# EAGLE design untitled (EAGLE 9.6.2)
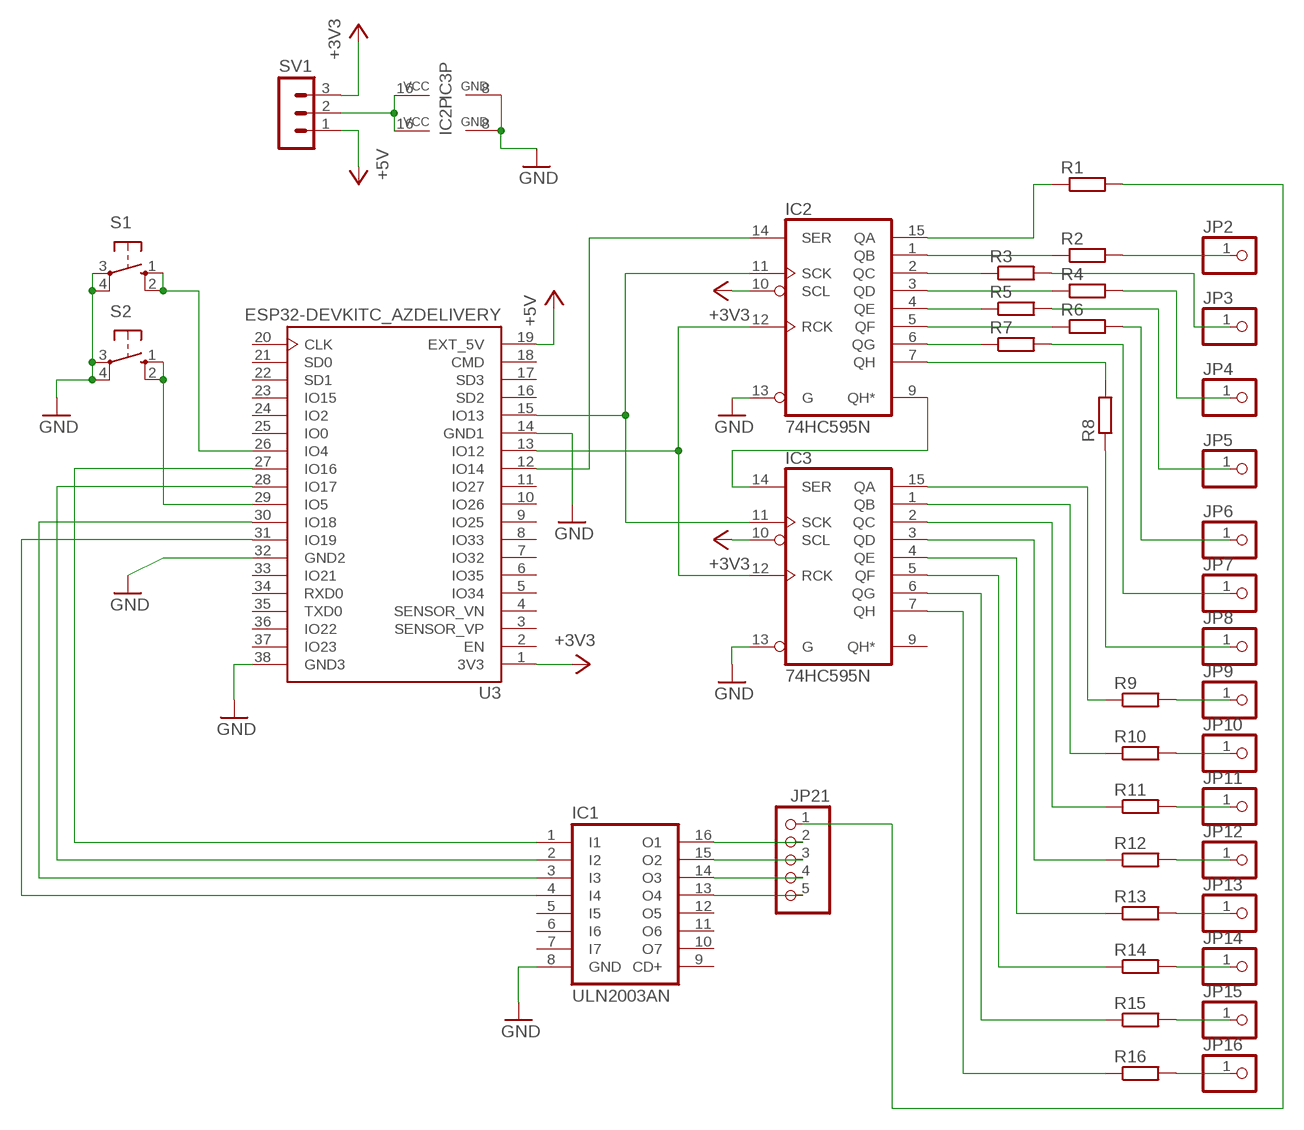
[diagram p0: schematic, sheet 1]

## Parts
IC1  ULN2003AN  [DIL16]
IC2  74HC595N  [DIL16]
IC3  74HC595N  [DIL16]
JP2  PINHD-1X1  [1X01]
JP3  PINHD-1X1  [1X01]
JP4  PINHD-1X1  [1X01]
JP5  PINHD-1X1  [1X01]
JP6  PINHD-1X1  [1X01]
JP7  PINHD-1X1  [1X01]
JP8  PINHD-1X1  [1X01]
JP9  PINHD-1X1  [1X01]
JP10  PINHD-1X1  [1X01]
JP11  PINHD-1X1  [1X01]
JP12  PINHD-1X1  [1X01]
JP13  PINHD-1X1  [1X01]
JP14  PINHD-1X1  [1X01]
JP15  PINHD-1X1  [1X01]
JP16  PINHD-1X1  [1X01]
JP21  PINHD-1X5  [1X05]
R1  R-EU_0207/10  [0207/10]
R2  R-EU_0207/10  [0207/10]
R3  R-EU_0207/10  [0207/10]
R4  R-EU_0207/10  [0207/10]
R5  R-EU_0207/10  [0207/10]
R6  R-EU_0207/10  [0207/10]
R7  R-EU_0207/10  [0207/10]
R8  R-EU_0207/10  [0207/10]
R9  R-EU_0207/10  [0207/10]
R10  R-EU_0207/10  [0207/10]
R11  R-EU_0207/10  [0207/10]
R12  R-EU_0207/10  [0207/10]
R13  R-EU_0207/10  [0207/10]
R14  R-EU_0207/10  [0207/10]
R15  R-EU_0207/10  [0207/10]
R16  R-EU_0207/10  [0207/10]
S1  10-XX  [B3F-10XX]
S2  10-XX  [B3F-10XX]
SV1  MA03-1  [MA03-1]
U3  ESP32-DEVKITC_AZDELIVERY  [FP_ESP32-DEVKIT_AZDELIVERY]

## Nets
+3V3: IC2.10(SCL) IC3.10(SCL) SV1.3 U3.1(3V3)
+5V: SV1.1 U3.19(EXT_5V)
GND: IC1.8(GND) IC2.8(GND) IC2.13(G) IC3.8(GND) IC3.13(G) S1.3(P) S1.4(P1) S2.3(P) S2.4(P1) U3.14(GND1) U3.32(GND2) U3.38(GND3)
N$1: IC2.11(SCK) IC3.11(SCK) U3.15(IO13)
N$2: IC2.12(RCK) IC3.12(RCK) U3.13(IO12)
N$3: IC2.14(SER) U3.12(IO14)
N$4: IC2.9(QH*) IC3.14(SER)
N$5: JP21.1 R1.2
N$6: IC1.16(O1) JP21.2
N$7: IC1.15(O2) JP21.3
N$8: IC1.14(O3) JP21.4
N$9: IC2.15(QA) R1.1
N$10: IC2.1(QB) R2.1
N$11: JP3.1 R3.2
N$12: JP4.1 R4.2
N$13: JP5.1 R5.2
N$14: JP6.1 R6.2
N$15: JP7.1 R7.2
N$16: JP8.1 R8.1
N$17: IC3.15(QA) R9.1
N$18: IC3.1(QB) R10.1
N$19: IC3.2(QC) R11.1
N$20: IC3.3(QD) R12.1
N$21: IC3.4(QE) R13.1
N$22: IC3.5(QF) R14.1
N$23: IC3.6(QG) R15.1
N$24: IC3.7(QH) R16.1
N$25: IC1.1(I1) U3.27(IO16)
N$26: IC1.2(I2) U3.28(IO17)
N$27: IC1.3(I3) U3.30(IO18)
N$28: IC1.4(I4) U3.31(IO19)
N$29: S1.1(S) S1.2(S1) U3.26(IO4)
N$30: S2.1(S) S2.2(S1) U3.29(IO5)
N$31: IC1.13(O4) JP21.5
N$32: JP2.1 R2.2
N$33: IC2.2(QC) R3.1
N$34: IC2.3(QD) R4.1
N$35: IC2.4(QE) R5.1
N$36: IC2.5(QF) R6.1
N$37: IC2.6(QG) R7.1
N$38: IC2.7(QH) R8.2
N$39: JP9.1 R9.2
N$40: JP10.1 R10.2
N$41: JP11.1 R11.2
N$42: JP12.1 R12.2
N$43: JP13.1 R13.2
N$44: JP14.1 R14.2
N$45: JP15.1 R15.2
N$46: JP16.1 R16.2
N$47: IC2.16(VCC) IC3.16(VCC) SV1.2
Unconnected: IC1.5(I5) IC1.6(I6) IC1.7(I7) IC1.9(CD+) IC1.10(O7) IC1.11(O6) IC1.12(O5) IC3.9(QH*) U3.2(EN) U3.3(SENSOR_VP) U3.4(SENSOR_VN) U3.5(IO34) U3.6(IO35) U3.7(IO32) U3.8(IO33) U3.9(IO25) U3.10(IO26) U3.11(IO27) U3.16(SD2) U3.17(SD3) U3.18(CMD) U3.20(CLK) U3.21(SD0) U3.22(SD1) U3.23(IO15) U3.24(IO2) U3.25(IO0) U3.33(IO21) U3.34(RXD0) U3.35(TXD0) U3.36(IO22) U3.37(IO23)

## Library data of the parts
IC1 = uln-udn:ULN2003A: DRIVER ARRAY
IC2 IC3 = 74xx-eu:74*595: 8-bit SHIFT REGISTER, output latch
JP2-JP16 = adafruit:PINHD-1X1: Pin header 1x1 for 0.1" spacing With round pins
JP21 = pinhead:PINHD-1X5: PIN HEADER
R1-R16 = rcl:R-EU_: RESISTOR, European symbol; SPICEPREFIX: R
S1 S2 = switch-omron:10-XX: OMRON SWITCH; MPN: B3F-1000; OC_FARNELL: 176432; OC_NEWARK: 36M3542
SV1 = con-lstb:MA03-1: PIN HEADER; OC_FARNELL: unknown; OC_NEWARK: unknown
U3 = ESP32-DEVKITC-AZDELIVERY:ESP32-DEVKITC_AZDELIVERY: Eval Board For Esp-Wroom-32; AVAILABILITY: Unavailable; DESCRIPTION: - Transceiver; 802.11 b/g/n _Wi-Fi, WiFi, WLAN_, Bluetooth® Smart Ready 4.x Dual Mode For Use With ESP-WROOM-32; MF: Espressif Systems; MP: ESP32-DEVKITC-32D; PACKAGE: None; PRICE: None

## Board
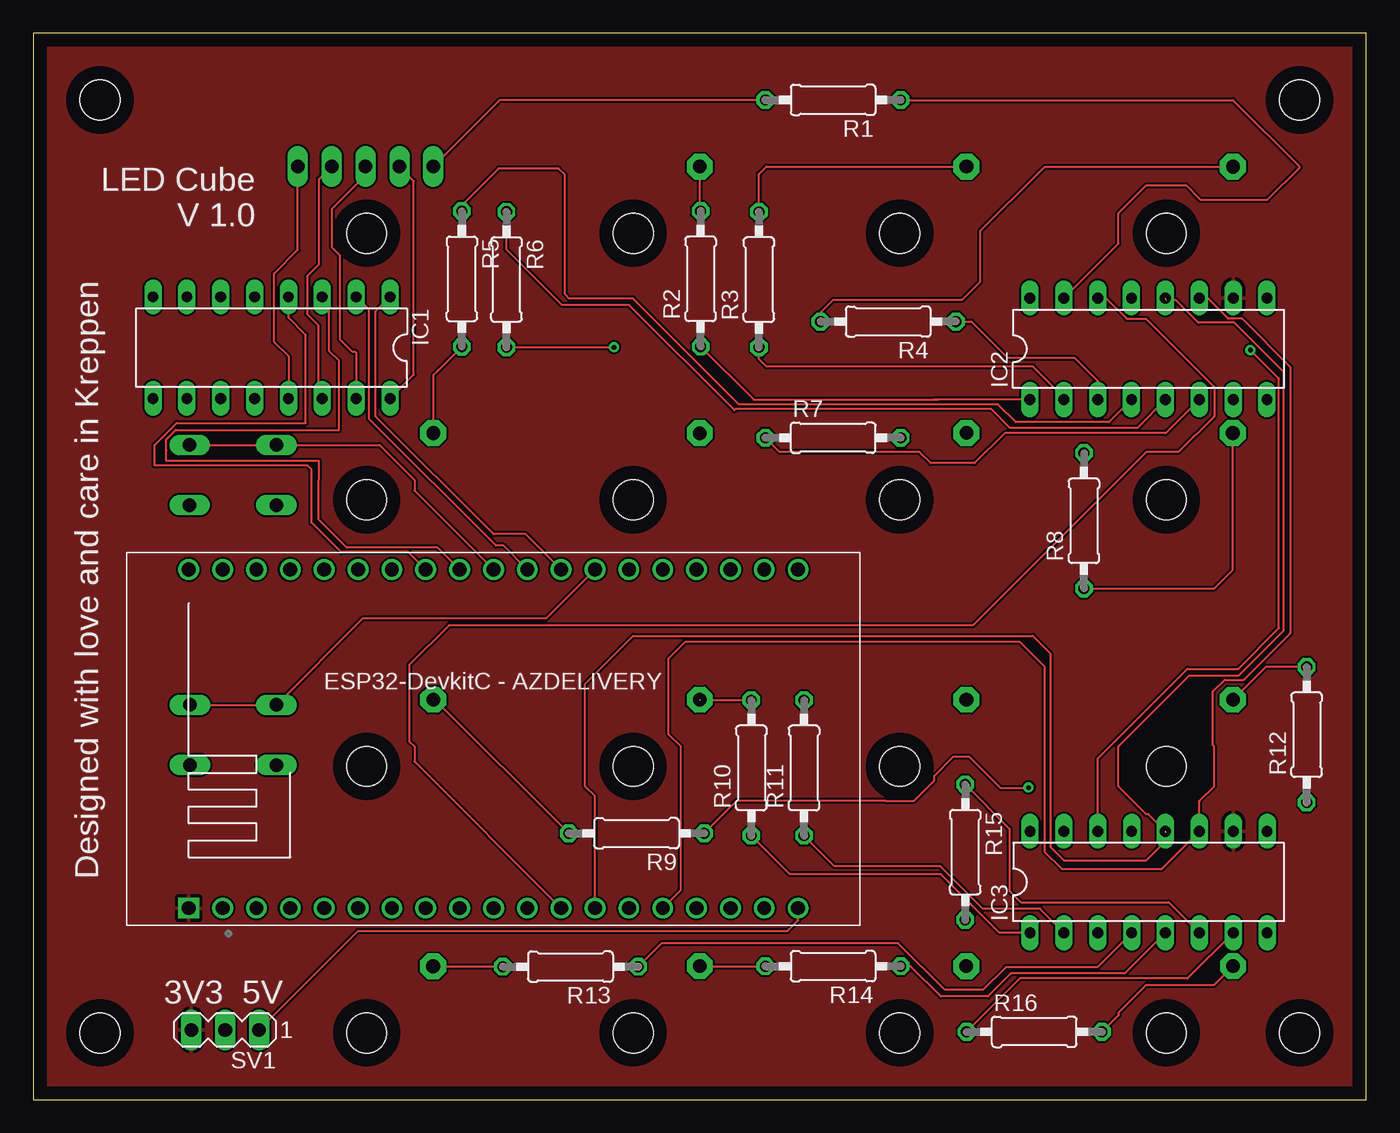
[diagram p1: board, top side]
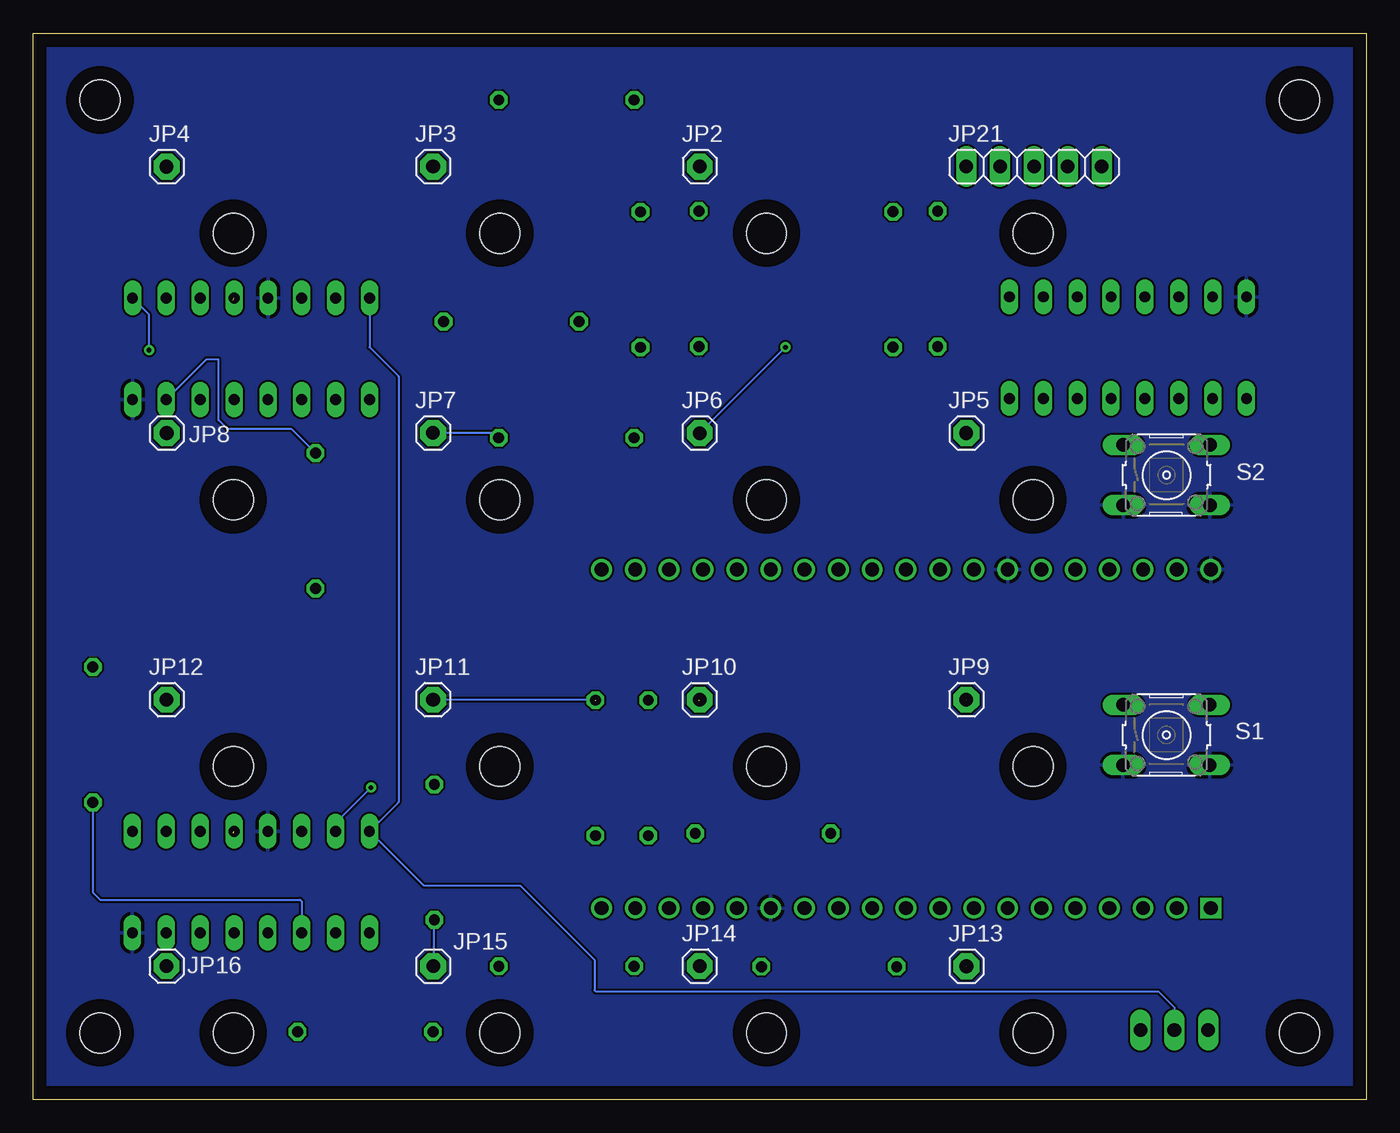
[diagram p2: board, bottom side, seen from below]

Size 100 x 80 mm. Coordinates in mm from the lower left corner, seen from the top.
Outline: 0,0 100,0 100,80 0,80 0,0
Copper layers (1*16): Top 0.035mm / dielectric 1.5mm / Bottom 0.035mm
Design rules "default": minimum track width 6mil, minimum drill 0.35mm, track to track 6mil, track to pad 6mil, pad to pad 6mil, via to via 6mil, smd to smd 6mil, copper to edge 40mil, drill to drill 6mil, minimum pad ring 10mil, minimum via ring 8mil, stop-mask expansion 4mil, vias tented up to drill 0mil, thermal gap 10mil
Holes 3 mm at 5,75 45,65 65,65 25,65 85,65 85,45 65,45 45,45 25,45 25,25 25,5 45,5 45,25 65,5 65,25 85,25 85,5 95,75 95,5 5,5

### Footprints (pad centres in the part's own frame; a part is rotated, then mirrored left to right if it is on the bottom)
DIL16 = drill 0.813 long: 1 -8.89,-3.81; 2 -6.35,-3.81; 3 -3.81,-3.81; 4 -1.27,-3.81; 5 1.27,-3.81; 6 3.81,-3.81; 7 6.35,-3.81; 8 8.89,-3.81; 9 8.89,3.81; 10 6.35,3.81; 11 3.81,3.81; 12 1.27,3.81; 13 -1.27,3.81; 14 -3.81,3.81; 15 -6.35,3.81; 16 -8.89,3.81
1X01 = drill 1.016 pad 1.93 octagon: 1 0,0
1X05 = drill 1.016 long: 1 -5.08,0; 2 -2.54,0; 3 0,0; 4 2.54,0; 5 5.08,0
0207/10 = drill 0.813 octagon: 1 -5.08,0; 2 5.08,0
B3F-10XX = drill 1.016 long: 1 -3.251,2.261; 2 3.251,2.261; 3 -3.251,-2.261; 4 3.251,-2.261
MA03-1 = drill 1.016 long: 1 -2.54,0; 2 0,0; 3 2.54,0
FP_ESP32-DEVKIT_AZDELIVERY = drill 1.04 square: 1 -12.7,22.86 | drill 1.04: 2 -12.7,20.32; 3 -12.7,17.78; 4 -12.7,15.24; 5 -12.7,12.7; 6 -12.7,10.16; 7 -12.7,7.62; 8 -12.7,5.08; 9 -12.7,2.54; 10 -12.7,0; 11 -12.7,-2.54; 12 -12.7,-5.08; 13 -12.7,-7.62; 14 -12.7,-10.16; 15 -12.7,-12.7; 16 -12.7,-15.24; 17 -12.7,-17.78; 18 -12.7,-20.32; 19 -12.7,-22.86; 20 12.7,-22.86; 21 12.7,-20.32; 22 12.7,-17.78; 23 12.7,-15.24; 24 12.7,-12.7; 25 12.7,-10.16; 26 12.7,-7.62; 27 12.7,-5.08; 28 12.7,-2.54; 29 12.7,0; 30 12.7,2.54; 31 12.7,5.08; 32 12.7,7.62; 33 12.7,10.16; 34 12.7,12.7; 35 12.7,15.24; 36 12.7,17.78; 37 12.7,20.32; 38 12.7,22.86

### Placement (x,y rotation side)
IC1  17.87,56.41 180 top
IC2  83.67,56.33 0 top
IC3  83.67,16.32 0 top
JP2  50,70 0 bottom
JP3  70.01,70 0 bottom
JP4  90,69.99 0 bottom
JP5  30,50.01 0 bottom
JP6  50.01,50 0 bottom
JP7  70.01,50.01 0 bottom
JP8  89.99,50.01 0 bottom
JP9  30,30 0 bottom
JP10  50.01,29.99 0 bottom
JP11  70.01,30 0 bottom
JP12  90,30 0 bottom
JP13  30,10 0 bottom
JP14  50.01,10 0 bottom
JP15  70,10 0 bottom
JP16  90,10.01 0 bottom
JP21  24.92,70 0 bottom
R1  60,75 180 top
R2  50.06,61.58 90 top
R3  54.44,61.52 90 top
R4  64.14,58.37 180 top
R5  32.15,61.58 270 top
R6  35.5,61.53 270 top
R7  60.01,49.65 0 top
R8  78.83,43.43 90 top
R9  45.26,19.97 180 top
R10  53.87,24.88 90 top
R11  57.83,24.88 90 top
R12  95.53,27.37 90 top
R13  40.3,9.97 180 top
R14  60,10 180 top
R15  69.92,18.56 270 top
R16  75.09,5.08 0 top
S1  14.99,27.35 0 bottom
S2  14.98,46.85 0 bottom
SV1  14.39,5.22 180 top
U3  34.52,27.06 90 top

### Tracks (layer width: path | path; a pad name or v marks a point on that pad's centre or on a via)
+3V3
  pour Top: 0,80 100,80 100,0 0,0
+5V
  Top 0.152: SV1.1 24.36,12.65 56.59,12.65 57.38,13.44 U3.19
GND
  pour Bottom: 0,80 100,80 100,0 0,0
N$1
  Top 0.152: IC2.11 88.1,60.14 89.65,58.59 90.69,58.59 94.34,54.94 94.34,35.02 90.82,31.5 89.38,31.5 88.5,30.62 88.5,26.58 88.59,26.49 88.59,23.51 87.48,22.4 IC3.11 84.65,17.3 77.15,17.3 75.86,18.59 75.86,32.48 73.99,34.35 48.94,34.35 47.67,33.08 47.67,27.41 48.59,26.49 48.59,15.73 U3.15
N$2  (2 unrouted)
  Top 0.152: IC3.12 83.66,21.41 83.51,21.41 81.41,23.51 81.41,26.49 86.72,31.8 90.43,31.8 93.82,35.2 93.82,54.59 90.12,58.28 87.42,58.28 85.7,60 85,60 | U3.13 42.14,22.78 41.41,23.51 41.41,31.2 45,34.79 75,34.79 76.31,33.49 76.31,18.97 77.32,17.95 83.52,17.95 85,19.44 85,20
N$3
  Top 0.152: IC2.14 80.48,60.14 82.03,58.59 83.46,58.59 88.59,53.46 88.59,51.26 85.92,48.59 83.51,48.59 70.5,35.59 31.18,35.59 28.21,32.62 28.21,26.87 28.59,26.49 28.59,25.37 U3.12
N$4  (via drill 0.35)
  Top 0.152: IC3.14 79.86,25.59 86.58,32.31 90.34,32.31 90.36,32.28 93.45,35.37 93.45,54.1 v91.31,56.24
  Bottom 0.152: v91.31,56.24 91.31,58.89 IC2.9
N$5
  Top 0.152: JP21.1 35,75 R1.2
N$6
  Top 0.152: IC1.16 28.55,54.39 28.55,68.92 JP21.2
N$7
  Top 0.152: IC1.15 24.22,56.03 24.13,56.12 23.92,56.12 22.99,57.05 22.99,63.34 22.41,63.93 22.41,66.83 24.99,69.42 24.99,69.94 JP21.3
N$8
  Top 0.152: IC1.14 21.38,52.9 21.38,58.1 20.54,58.93 20.54,61.77 21.44,62.67 21.44,69.06 JP21.4
N$9
  Top 0.152: IC2.15 81.41,64.23 81.41,66.49 83.51,68.59 86.49,68.59 87.58,67.51 92.59,67.51 95,69.92 95,70 90,75 R1.1
N$10
  Top 0.152: IC2.1 67.88,52.52 | 67.88,52.52 67.48,52.52 | R2.1 54.06,52.5 67.87,52.5 67.88,52.52
N$11
  Top 0.152: R3.2 54.44,69.44 55,70 JP3.1
N$12
  Top 0.152: R4.2 59.06,59.06 60,60 69.68,60 71.03,61.35 71.03,65.15 75.44,69.56 75.88,69.99 JP4.1
N$13
  Top 0.152: R5.2 30.33,54.67 30,54.34 JP5.1
N$14  (via drill 0.35)
  Top 0.152: R6.2 v43.56,56.45
  Bottom 0.152: v43.56,56.45 JP6.1
N$15
  Bottom 0.152: JP7.1 65.44,50.01 R7.2
N$16
  Top 0.152: R8.1 88.6,38.35 89.99,39.74 JP8.1
  Bottom 0.152: 90.02,50.03 JP8.1
N$17  (via drill 0.35)
  Top 0.152: R9.1 52.8,22.44 63.9,22.44 63.93,22.41 66.07,22.41 67.59,23.93 67.59,24.28 69.05,25.74 70.19,25.74 72.56,23.37 74.64,23.37 v74.67,23.41
  Bottom 0.152: v74.67,23.41 77.32,20.75 IC3.15
N$18
  Top 0.152: IC3.1 72.49,12.51 68.1,16.9 56.77,16.9 R10.1
N$19
  Top 0.152: IC3.2 75.52,14.31 71.26,14.31 68.07,17.5 60.12,17.5 R11.1
N$20
  Bottom 0.152: R12.1 95.53,15.53 95,15 80,15 79.86,14.86 IC3.3
N$21
  Top 0.152: IC3.4 79.83,9.93 72.96,9.93 71.26,8.23 68.38,8.23 64.87,11.74 47.15,11.74 R13.1
N$22
  Top 0.152: IC3.5 81.89,9.46 73.35,9.46 71.63,7.74 68.09,7.74 65.82,10 R14.1
N$23
  Top 0.152: R15.1 73.25,20.31 73.25,15.66 74.09,14.81 85.18,14.81 IC3.6
N$24
  Top 0.152: 90,12.49 IC3.7 86.59,9.08 74.01,9.08 R16.1
N$25
  Top 0.152: 26.9,60.22 IC1.1 25.69,59.15 25.69,51.26 34.52,42.43 36.93,42.43 U3.27
N$26
  Top 0.152: U3.28 35.26,41.56 34.71,41.56 25.19,51.07 25.19,59.25 IC1.2
N$27
  Top 0.152: U3.30 30.33,41.41 23.51,41.41 21.41,43.51 21.41,46.49 21.44,46.52 21.44,47.9 21.42,47.92 10,47.92 9.98,47.95 9.98,48.7 | 9.98,48.7 9.98,49.52 10.7,50.24 22.93,50.24 22.93,55.45 22.2,56.17 22.2,59.7 IC1.3 | 10,48.68 9.98,48.7
N$28
  Top 0.152: U3.31 28.16,41.05 28.16,41.08 23.08,41.08 20.88,43.28 20.88,47.26 20.57,47.57 9.1,47.57 9.1,49.12 10.74,50.76 20.44,50.76 20.44,57.36 19.14,58.66 IC1.4
N$29
  Top 0.152: S1.2 S1.1 24.75,36.11 38.49,36.11 U3.26
N$30
  Top 0.152: S2.2 S2.1 25.97,49.11 28.59,46.49 28.59,45.69 U3.29
N$31
  Top 0.152: IC1.13 19.14,55.77 18.07,56.84 18.07,61.98 19.84,63.76 JP21.5
N$32
  Top 0.152: R2.2 50,66.72 JP2.1
N$33
  Top 0.152: IC2.2 77.32,52.68 75,55 55,55 54.44,55.56 R3.1
N$34
  Top 0.152: R4.1 70.38,58.37 73.08,55.66 78.1,55.66 79.86,53.91 IC2.3
N$35
  Top 0.152: IC2.4 80.71,50.83 73.7,50.83 72.38,52.15 52.96,52.15 45,60.11 40.2,60.11 39.88,60.43 39.88,69.39 39.41,69.86 34.9,69.86 32.15,67.11 R5.1
N$36
  Top 0.152: IC2.5 82.82,50.4 73.27,50.4 71.88,51.79 52.67,51.79 52.6,51.72 44.7,59.62 39.68,59.62 39.66,59.61 35.5,63.77 R6.1
N$37
  Top 0.152: IC2.6 84.96,50 72.88,50 70.62,47.74 67.34,47.74 66.49,48.59 55.99,48.59 R7.1
N$38
  Bottom 0.152: R8.2 80.61,50.29 85.42,50.29 86.1,50.97 86.1,55.52 87.02,55.52 IC2.7
N$39  (1 unrouted)
  Top 0.152: R9.2 30.15,30 JP9.1
N$40  (1 unrouted)
  Top 0.152: R10.2 50.05,29.96
N$41  (1 unrouted)
  Bottom 0.152: 57.87,30 JP11.1
N$42
  Top 0.152: R12.2 92.45,32.45 JP12.1
N$43  (1 unrouted)
  Top 0.152: R13.2 30.03,9.97 JP13.1
N$44
  Top 0.152: JP14.1 R14.2
N$45
  Bottom 0.152: JP15.1 69.92,10.08 R15.2
N$46
  Top 0.152: R16.2 81.41,6.31 81.41,6.49 83.51,8.59 88.59,8.59 JP16.1
N$47
  Bottom 0.152: IC2.16 74.78,56.44 72.61,54.27 72.61,22.3 IC3.16 70.71,16.06 63.47,16.06 57.9,10.49 57.9,8.21 57.8,8.11 15.59,8.11 14.39,6.92 SV1.2

### Text on the board
tNames: LED Cube / V 1.0 | Designed with love and care in Kreppen | 3V3 5V